# Altium schematic sheet display.SchDoc
size A3; Hw_rev: 0; License: GPLv3; Address3: Firenze; Address4: ITALY; Revision: 0; SheetNumber: 1; SheetTotal: 1
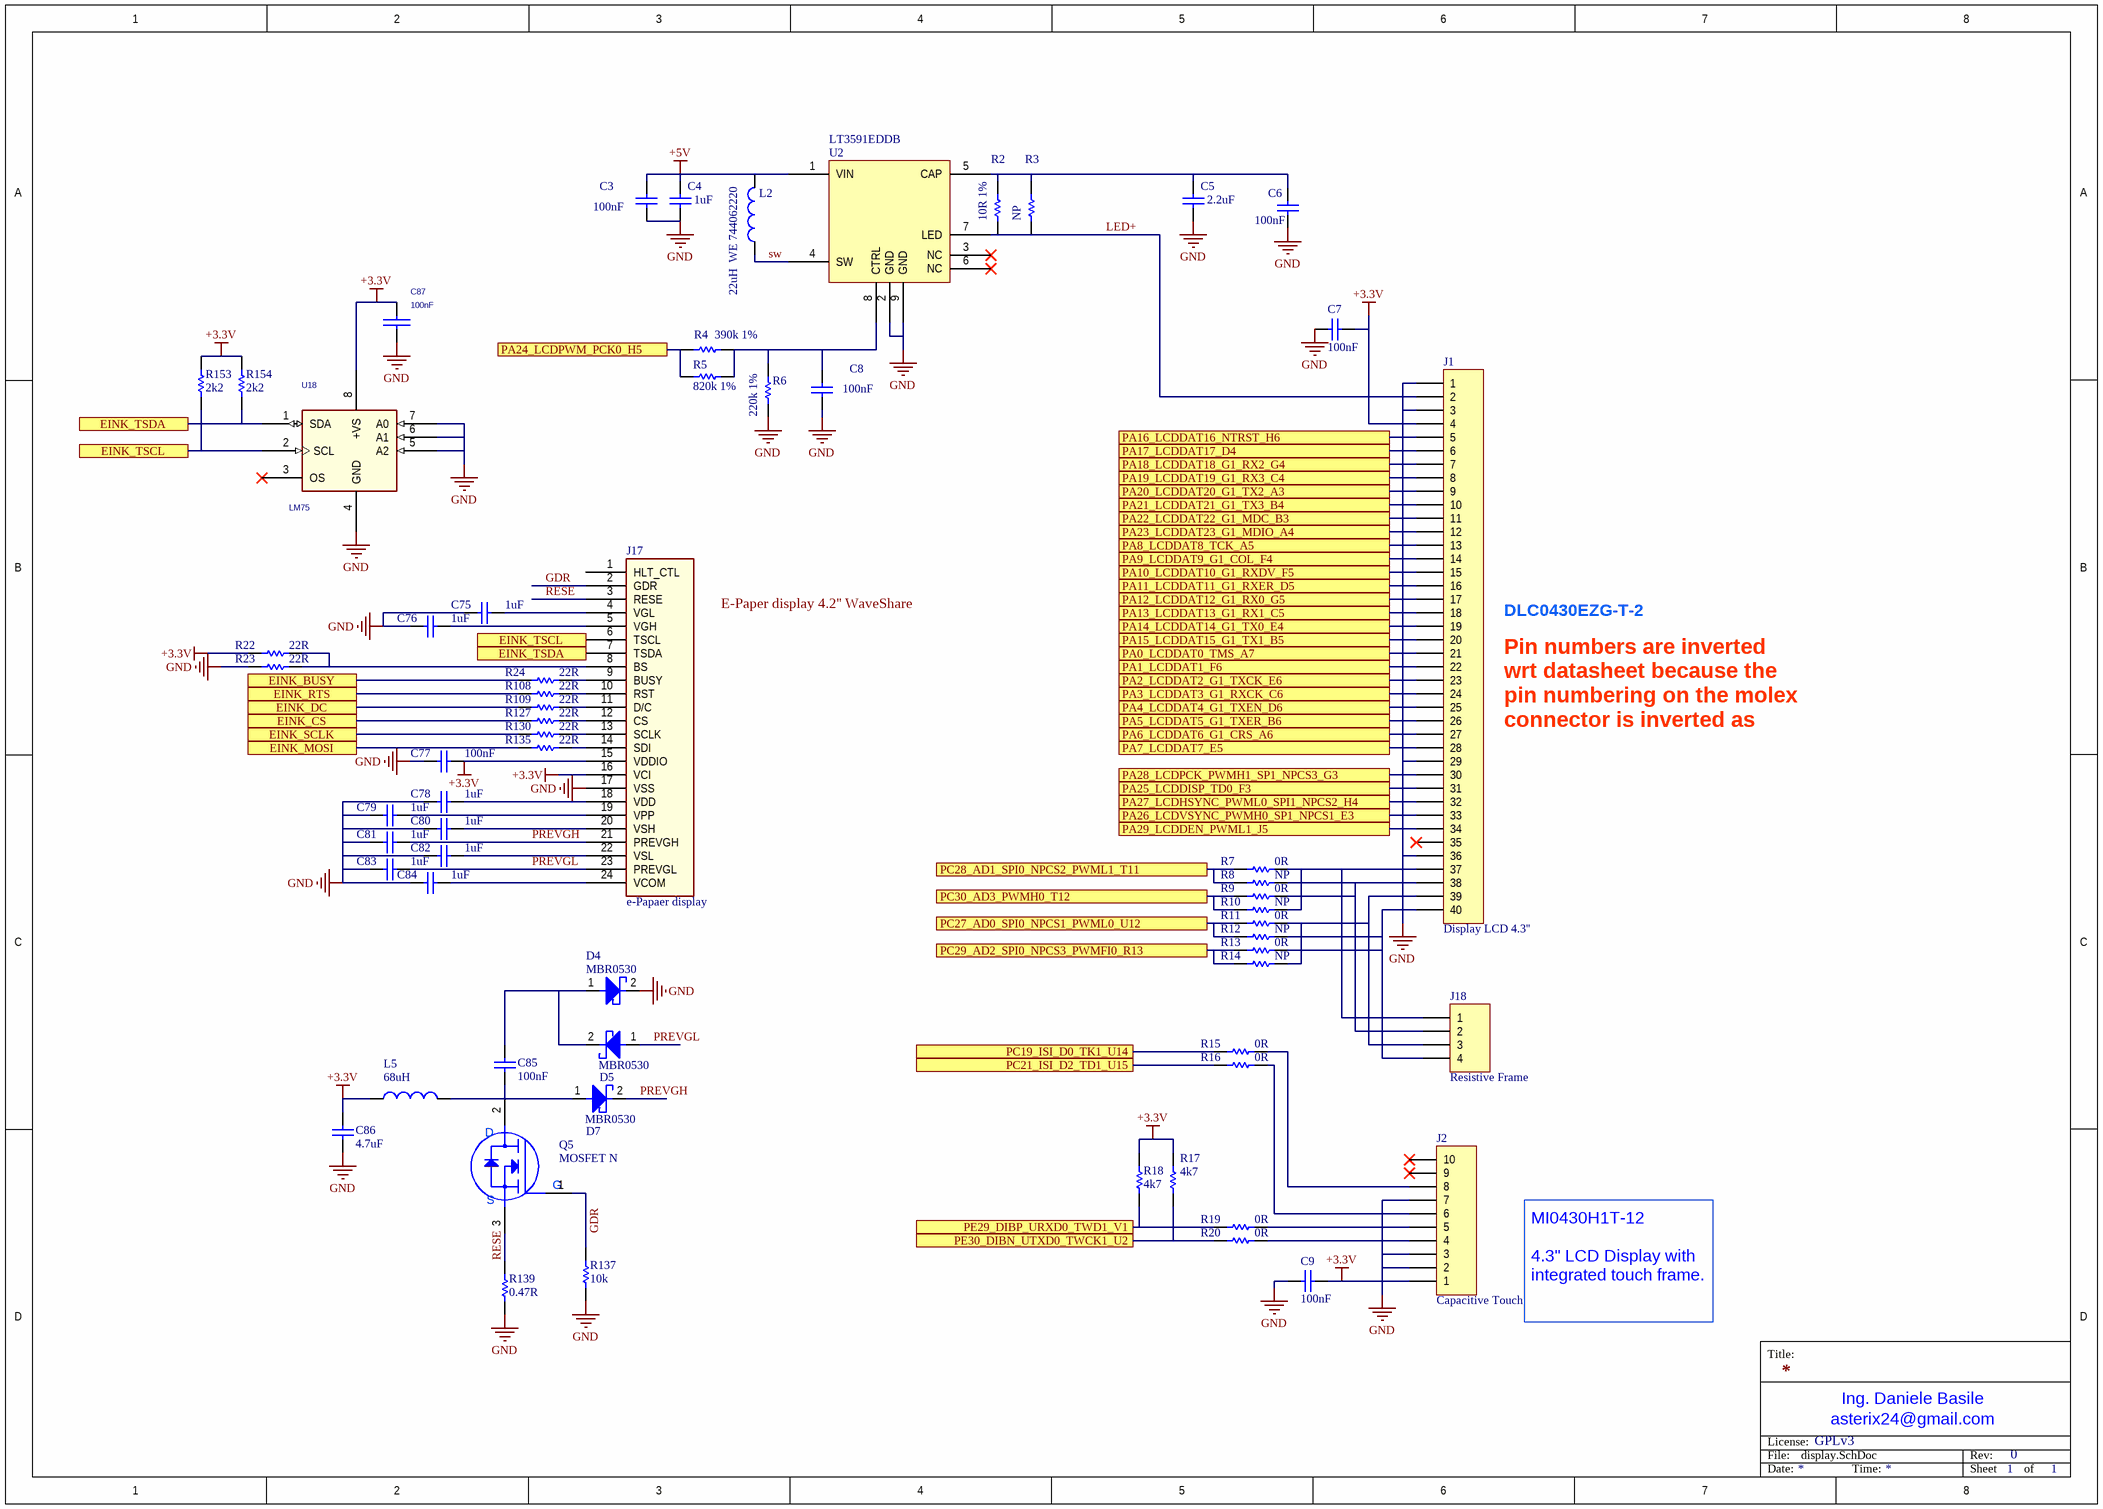
[diagram p0: display.SchDoc]

## Parts
C3  100nF  [0603_[1608]]
C4  1uF  [0805_[2012]]
C5  2.2uF  [1210_[3225]]
C6  100nF  [0603_[1608]]
C7  100nF  [0603_[1608]]
C8  100nF  [0603_[1608]]
C9  100nF  [0603_[1608]]
C75  1uF  [0603_[1608]]
C76  1uF  [0603_[1608]]
C77  100nF  [0603_[1608]]
C78  1uF  [0603_[1608]]
C79  1uF  [0603_[1608]]
C80  1uF  [0603_[1608]]
C81  1uF  [0603_[1608]]
C82  1uF  [0603_[1608]]
C83  1uF  [0603_[1608]]
C84  1uF  [0603_[1608]]
C85  100nF  [0603_[1608]]
C86  4.7uF  [0603_[1608]]
C87  100nF  [0603_[1608]]
D4  MBR0530  [SOD-123_K2-A1]
D5  MBR0530  [SOD-123_K2-A1]
D7  MBR0530  [SOD-123_K2-A1]
J1  Display LCD 4.3''  [fcc-zif_40pin_0.5mm]
J2  Capacitive Touch  [fcc-zif_10pin_0.5mm]
J17  e-Papaer display  [fcc-zif_24pin_0.5mm]
J18  Resistive Frame  [fcc-zif_4pin_1mm]
L2  22uH  WE 744062220  [WE-TPC-6823-X]
L5  68uH  [WE-TPC-6823-X]
Q5  MOSFET N  [sot-23]
R2  10R 1%  [0603_[1608]]
R3  NP  [0603_[1608]]
R4  390k 1%  [0603_[1608]]
R5  820k 1%  [0603_[1608]]
R6  220k 1%  [0603_[1608]]
R7  0R  [0603_[1608]]
R8  NP  [0603_[1608]]
R9  0R  [0603_[1608]]
R10  NP  [0603_[1608]]
R11  0R  [0603_[1608]]
R12  NP  [0603_[1608]]
R13  0R  [0603_[1608]]
R14  NP  [0603_[1608]]
R15  0R  [0603_[1608]]
R16  0R  [0603_[1608]]
R17  4k7  [0603_[1608]]
R18  4k7  [0603_[1608]]
R19  0R  [0603_[1608]]
R20  0R  [0603_[1608]]
R22  22R  [0603_[1608]]
R23  22R  [0603_[1608]]
R24  22R  [0603_[1608]]
R108  22R  [0603_[1608]]
R109  22R  [0603_[1608]]
R127  22R  [0603_[1608]]
R130  22R  [0603_[1608]]
R135  22R  [0603_[1608]]
R137  10k  [0603_[1608]]
R139  0.47R  [0603_[1608]]
R153  2k2  [0603_[1608]]
R154  2k2  [0603_[1608]]
U2  LT3591EDDB  [PQFN50P300X200X75_HS-9L]
U18  LM75  [SOIC8]

## Ports
EINK_BUSY, EINK_CS, EINK_DC, EINK_MOSI, EINK_RTS, EINK_SCLK, EINK_TSCL, EINK_TSDA, PA0_LCDDAT0_TMS_A7, PA1_LCDDAT1_F6, PA2_LCDDAT2_G1_TXCK_E6, PA3_LCDDAT3_G1_RXCK_C6, PA4_LCDDAT4_G1_TXEN_D6, PA5_LCDDAT5_G1_TXER_B6, PA6_LCDDAT6_G1_CRS_A6, PA7_LCDDAT7_E5, PA8_LCDDAT8_TCK_A5, PA9_LCDDAT9_G1_COL_F4, PA10_LCDDAT10_G1_RXDV_F5, PA11_LCDDAT11_G1_RXER_D5, PA12_LCDDAT12_G1_RX0_G5, PA13_LCDDAT13_G1_RX1_C5, PA14_LCDDAT14_G1_TX0_E4, PA15_LCDDAT15_G1_TX1_B5, PA16_LCDDAT16_NTRST_H6, PA17_LCDDAT17_D4, PA18_LCDDAT18_G1_RX2_G4, PA19_LCDDAT19_G1_RX3_C4, PA20_LCDDAT20_G1_TX2_A3, PA21_LCDDAT21_G1_TX3_B4, PA22_LCDDAT22_G1_MDC_B3, PA23_LCDDAT23_G1_MDIO_A4, PA24_LCDPWM_PCK0_H5, PA25_LCDDISP_TD0_F3, PA26_LCDVSYNC_PWMH0_SP1_NPCS1_E3, PA27_LCDHSYNC_PWML0_SPI1_NPCS2_H4, PA28_LCDPCK_PWMH1_SP1_NPCS3_G3, PA29_LCDDEN_PWML1_J5, PC19_ISI_D0_TK1_U14, PC21_ISI_D2_TD1_U15, PC27_AD0_SPI0_NPCS1_PWML0_U12, PC28_AD1_SPI0_NPCS2_PWML1_T11, PC29_AD2_SPI0_NPCS3_PWMFI0_R13, PC30_AD3_PWMH0_T12, PE29_DIBP_URXD0_TWD1_V1, PE30_DIBN_UTXD0_TWCK1_U2

## Nets
+3.3V: C7.1 C9.1 C77.1 C86.1 C87.1 J1.4 J2.1 J17.15(VDDIO) J17.16(VCI) L5.1 R17.1 R18.1 R22.2 R153.1 R154.1 U18.8(+VS)
+5V: C3.2 C4.2 L2.2 U2.1(VIN)
GND: C3.1 C4.1 C5.1 C6.1 C7.2 C8.1 C9.2 C75.2 C76.2 C77.2 C78.2 C79.2 C80.2 C81.2 C82.2 C83.2 C84.2 C86.2 C87.2 D4.2(K) J1.1 J1.3 J1.29 J1.36 J2.2 J2.3 J2.7 J17.17(VSS) R6.2 R23.2 R137.2 R139.2 U2.2(GND) U2.9(GND) U18.4(GND) U18.5(A2) U18.6(A1) U18.7(A0)
EINK_BUSY: R24.2 ; port EINK_BUSY
EINK_CS: R127.2 ; port EINK_CS
EINK_DC: R109.2 ; port EINK_DC
EINK_MOSI: R135.2 ; port EINK_MOSI
EINK_RTS: R108.2 ; port EINK_RTS
EINK_SCLK: R130.2 ; port EINK_SCLK
EINK_TSCL: J17.6(TSCL) R153.2 U18.2(SCL) ; port EINK_TSCL
EINK_TSDA: J17.7(TSDA) R154.2 U18.1(SDA) ; port EINK_TSDA
GDR: J17.2(GDR) Q5.1(G) R137.1
LED+: J1.2 R2.1 R3.1 U2.7(LED)
PA0_LCDDAT0_TMS_A7: J1.21 ; port PA0_LCDDAT0_TMS_A7
PA1_LCDDAT1_F6: J1.22 ; port PA1_LCDDAT1_F6
PA2_LCDDAT2_G1_TXCK_E6: J1.23 ; port PA2_LCDDAT2_G1_TXCK_E6
PA3_LCDDAT3_G1_RXCK_C6: J1.24 ; port PA3_LCDDAT3_G1_RXCK_C6
PA4_LCDDAT4_G1_TXEN_D6: J1.25 ; port PA4_LCDDAT4_G1_TXEN_D6
PA5_LCDDAT5_G1_TXER_B6: J1.26 ; port PA5_LCDDAT5_G1_TXER_B6
PA6_LCDDAT6_G1_CRS_A6: J1.27 ; port PA6_LCDDAT6_G1_CRS_A6
PA7_LCDDAT7_E5: J1.28 ; port PA7_LCDDAT7_E5
PA8_LCDDAT8_TCK_A5: J1.13 ; port PA8_LCDDAT8_TCK_A5
PA9_LCDDAT9_G1_COL_F4: J1.14 ; port PA9_LCDDAT9_G1_COL_F4
PA10_LCDDAT10_G1_RXDV_F5: J1.15 ; port PA10_LCDDAT10_G1_RXDV_F5
PA11_LCDDAT11_G1_RXER_D5: J1.16 ; port PA11_LCDDAT11_G1_RXER_D5
PA12_LCDDAT12_G1_RX0_G5: J1.17 ; port PA12_LCDDAT12_G1_RX0_G5
PA13_LCDDAT13_G1_RX1_C5: J1.18 ; port PA13_LCDDAT13_G1_RX1_C5
PA14_LCDDAT14_G1_TX0_E4: J1.19 ; port PA14_LCDDAT14_G1_TX0_E4
PA15_LCDDAT15_G1_TX1_B5: J1.20 ; port PA15_LCDDAT15_G1_TX1_B5
PA16_LCDDAT16_NTRST_H6: J1.5 ; port PA16_LCDDAT16_NTRST_H6
PA17_LCDDAT17_D4: J1.6 ; port PA17_LCDDAT17_D4
PA18_LCDDAT18_G1_RX2_G4: J1.7 ; port PA18_LCDDAT18_G1_RX2_G4
PA19_LCDDAT19_G1_RX3_C4: J1.8 ; port PA19_LCDDAT19_G1_RX3_C4
PA20_LCDDAT20_G1_TX2_A3: J1.9 ; port PA20_LCDDAT20_G1_TX2_A3
PA21_LCDDAT21_G1_TX3_B4: J1.10 ; port PA21_LCDDAT21_G1_TX3_B4
PA22_LCDDAT22_G1_MDC_B3: J1.11 ; port PA22_LCDDAT22_G1_MDC_B3
PA23_LCDDAT23_G1_MDIO_A4: J1.12 ; port PA23_LCDDAT23_G1_MDIO_A4
PA24_LCDPWM_PCK0_H5: R4.2 R5.1 ; port PA24_LCDPWM_PCK0_H5
PA25_LCDDISP_TD0_F3: J1.31 ; port PA25_LCDDISP_TD0_F3
PA26_LCDVSYNC_PWMH0_SP1_NPCS1_E3: J1.33 ; port PA26_LCDVSYNC_PWMH0_SP1_NPCS1_E3
PA27_LCDHSYNC_PWML0_SPI1_NPCS2_H4: J1.32 ; port PA27_LCDHSYNC_PWML0_SPI1_NPCS2_H4
PA28_LCDPCK_PWMH1_SP1_NPCS3_G3: J1.30 ; port PA28_LCDPCK_PWMH1_SP1_NPCS3_G3
PA29_LCDDEN_PWML1_J5: J1.34 ; port PA29_LCDDEN_PWML1_J5
PC19_ISI_D0_TK1_U14: R15.2 ; port PC19_ISI_D0_TK1_U14
PC21_ISI_D2_TD1_U15: R16.2 ; port PC21_ISI_D2_TD1_U15
PC27_AD0_SPI0_NPCS1_PWML0_U12: R11.2 R12.2 ; port PC27_AD0_SPI0_NPCS1_PWML0_U12
PC28_AD1_SPI0_NPCS2_PWML1_T11: R7.2 R8.2 ; port PC28_AD1_SPI0_NPCS2_PWML1_T11
PC29_AD2_SPI0_NPCS3_PWMFI0_R13: R13.2 R14.2 ; port PC29_AD2_SPI0_NPCS3_PWMFI0_R13
PC30_AD3_PWMH0_T12: R9.2 R10.2 ; port PC30_AD3_PWMH0_T12
PE29_DIBP_URXD0_TWD1_V1: R18.2 R19.2 ; port PE29_DIBP_URXD0_TWD1_V1
PE30_DIBN_UTXD0_TWCK1_U2: R17.2 R20.2 ; port PE30_DIBN_UTXD0_TWCK1_U2
PREVGH: C81.1 D7.2(K) J17.21(PREVGH)
PREVGL: C83.1 D5.1(A) J17.23(PREVGL)
RESE: J17.3(RESE) Q5.3(S) R139.1
sw: L2.1 U2.4(SW)
NetC5_2: C5.2 C6.2 R2.2 R3.2 U2.5(CAP)
NetC8_2: C8.2 R4.1 R5.2 R6.1 U2.8(CTRL)
NetC75_1: C75.1 J17.4(VGL)
NetC76_1: C76.1 J17.5(VGH)
NetC78_1: C78.1 J17.18(VDD)
NetC79_1: C79.1 J17.19(VPP)
NetC80_1: C80.1 J17.20(VSH)
NetC82_1: C82.1 J17.22(VSL)
NetC84_1: C84.1 J17.24(VCOM)
NetC85_1: C85.1 D4.1(A) D5.2(K)
NetC85_2: C85.2 D7.1(A) L5.2 Q5.2(D)
NetJ1_37: J1.37 J18.1 R7.1 R10.1
NetJ1_38: J1.38 J18.2 R8.1 R9.1
NetJ1_39: J1.39 J18.3 R11.1 R14.1
NetJ1_40: J1.40 J18.4 R12.1 R13.1
NetJ2_4: J2.4 R20.1
NetJ2_5: J2.5 R19.1
NetJ2_6: J2.6 R16.1
NetJ2_8: J2.8 R15.1
NetJ17_8: J17.8(BS) R22.1 R23.1
NetJ17_9: J17.9(BUSY) R24.1
NetJ17_10: J17.10(RST) R108.1
NetJ17_11: J17.11(D/C) R109.1
NetJ17_12: J17.12(CS) R127.1
NetJ17_13: J17.13(SCLK) R130.1
NetJ17_14: J17.14(SDI) R135.1

Not connected (* = marked no-connect by the designer): J1 35*; J2 9* 10*; J17 1(HLT_CTL); U2 3(NC)* 6(NC)*; U18 3(OS)*

## Notes on the sheet
- E-Paper display 4.2'' WaveShare
- DLC0430EZG-T-2
- Pin numbers are inverted wrt datasheet because the pin numbering on the molex connector is inverted as well!
- MI0430H1T-12
  4.3'' LCD Display with integrated touch frame.
- Title:
- File:
- License:
- asterix24@gmail.com
- Ing. Daniele Basile
- Rev:
- Date:
- Time:
- Sheet
- of

## Library data of the parts
C3 C4 C6-C9 C75-C86 = Cap: Ceramic X7R 50V; Value: 10nF; Published: 8-Jun-2000; Revision: July-2002: Re-released for DXP Platform.; Publisher: Altium Limited
C5 = Cap: Ceramic X7R, X5R 50V; Value: 10nF; Published: 8-Jun-2000; Revision: July-2002: Re-released for DXP Platform.; Publisher: Altium Limited
C87 = C: Ceramic X7R 50V
D4 D5 D7 = Diode_SCHOTTKY: Schottky Diodes
J1 = Header 40: 40-pin, 0.5mm, SMT, ZIF, Horizontal, Top Contact (WE 68714014022; Molex: 54104-4031); LatestRevisionDate: 17-Jul-2002; LatestRevisionNote: Re-released for DXP Platform.; Publisher: Altium Limited
J2 = Header 10: 10-pin, 0.5mm, SMT, ZIF, Horizontal, Top Contact; LatestRevisionDate: 17-Jul-2002; LatestRevisionNote: Re-released for DXP Platform.; Publisher: Altium Limited
J17 = e-paper_display_waveshare: e-paper display wave share
J18 = Header 4: Zip FCC connector; LatestRevisionDate: 17-Jul-2002; LatestRevisionNote: Re-released for DXP Platform.; Publisher: Altium Limited
L2 L5 = Inductor: Power Inductor
Q5 = MOSFET-N 3pin: MOSFET Channl N
R2 = Res1: Resistor 0.125W; Value: 1K; Published: 8-Jun-2000; Revision: July-2002: Re-released for DXP Platform.; Publisher: Altium Limited
R3-R20 R22-R24 R108 R109 R127 R130 R135 R137 R139 R153 R154 = Res1: Resistor; Value: 1K; Published: 8-Jun-2000; Revision: July-2002: Re-released for DXP Platform.; Publisher: Altium Limited
U2 = LT3591: White LED Driver with Integrated Schottky
U18 = LM75: IC LM75BIM-3.0